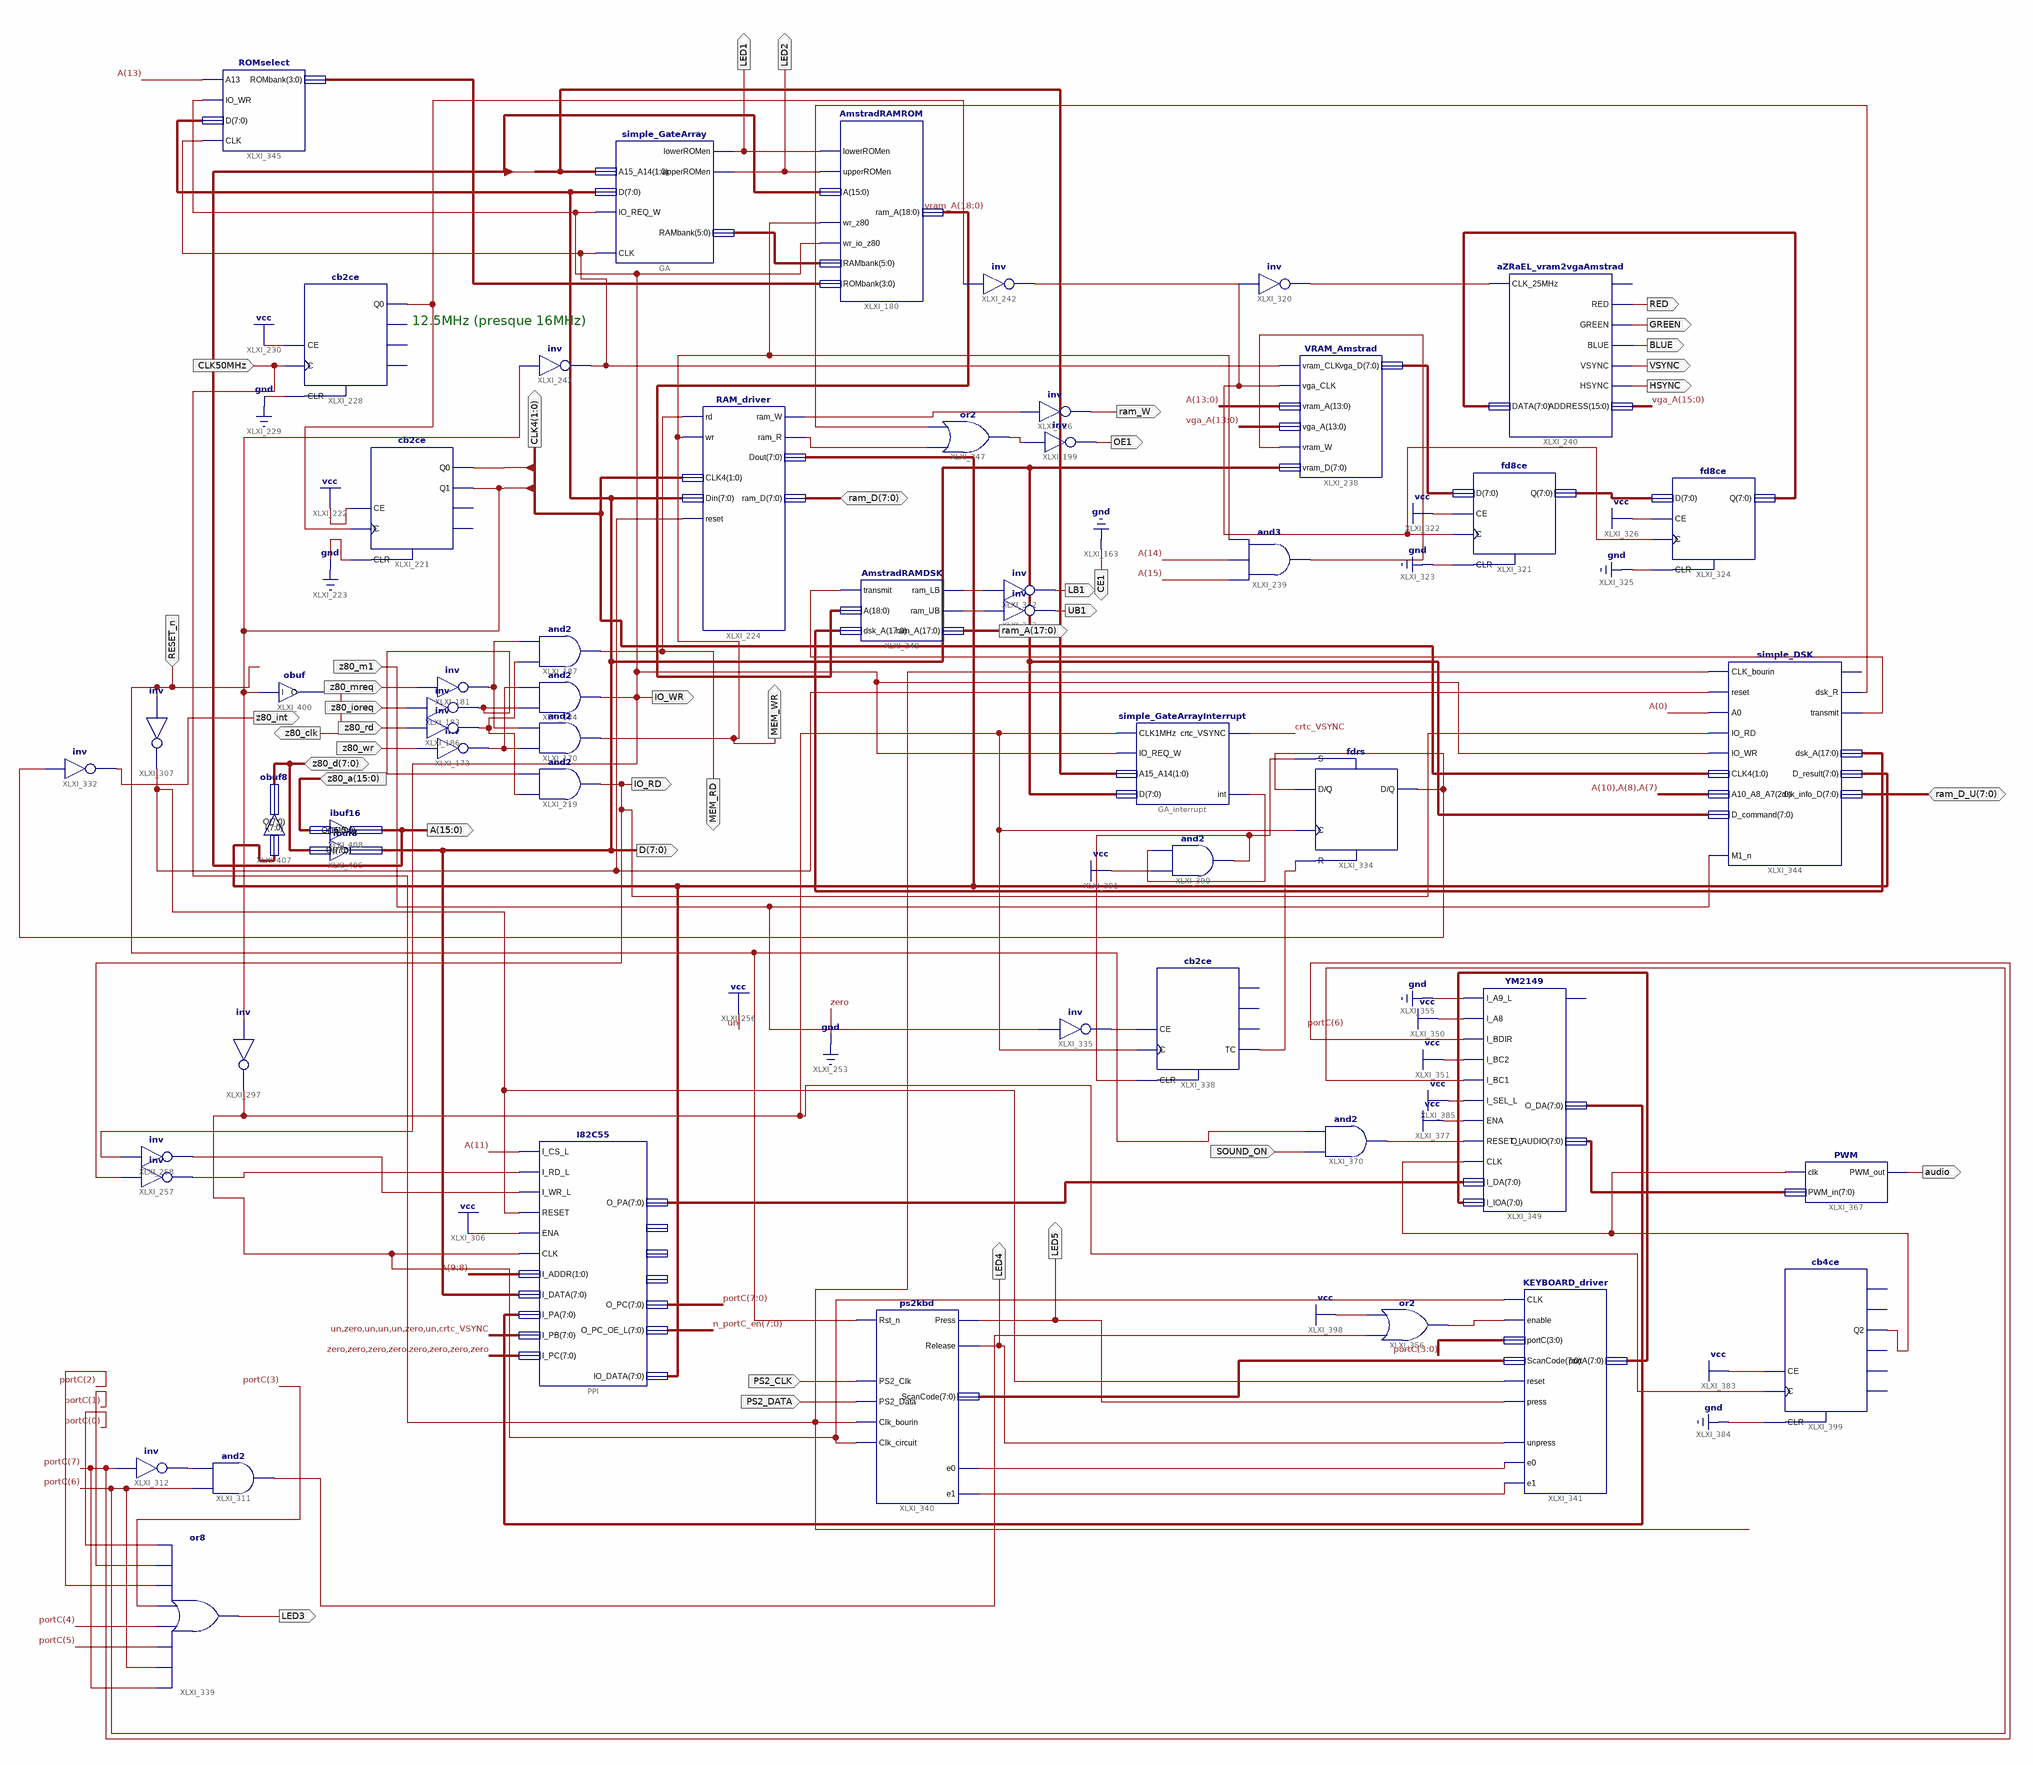
[diagram p0: schematic sheet 1]
// Xilinx ISE schematic amstrad_switch_z80_vga_externalZ80.sch (spartan3) as structural Verilog: 54 symbols, 40 ports
module amstrad_switch_z80_vga_externalZ80 (
  input  z80_wr,
  input  z80_mreq,
  input  z80_ioreq,
  input  z80_rd,
  input  RESET_n,
  input  CLK50MHz,
  input  z80_m1,
  input  PS2_CLK,
  input  PS2_DATA,
  input  SOUND_ON,
  input  [15:0] z80_a,
  inout  [7:0] ram_D,
  inout  [7:0] ram_D_U,
  inout  [7:0] z80_d,
  output LED1,
  output LED2,
  output [15:0] A,
  output IO_WR,
  output MEM_RD,
  output MEM_WR,
  output [7:0] D,
  output IO_RD,
  output [1:0] CLK4,
  output RED,
  output GREEN,
  output BLUE,
  output VSYNC,
  output HSYNC,
  output LED3,
  output LED5,
  output LED4,
  output CE1,
  output z80_int,
  output ram_W,
  output OE1,
  output UB1,
  output LB1,
  output [17:0] ram_A,
  output audio,
  output z80_clk
);

  wire crtc_VSYNC, XLXN_37, XLXN_76, XLXN_88, XLXN_115, XLXN_137, XLXN_142, XLXN_153, XLXN_180, XLXN_301,
       XLXN_309, XLXN_327, XLXN_337, XLXN_358, XLXN_359, XLXN_364, XLXN_370, XLXN_417, XLXN_418, XLXN_422,
       XLXN_423, XLXN_441, XLXN_445, XLXN_446, XLXN_450, XLXN_451, XLXN_459, XLXN_477, XLXN_478, XLXN_487,
       XLXN_497, XLXN_509, XLXN_521;
  wire [3:0] XLXN_435;
  wire [5:0] XLXN_434;
  wire [7:0] n_portC_en, portC, XLXN_283, XLXN_340, XLXN_344, XLXN_408, XLXN_452, XLXN_462, XLXN_486,
       XLXN_518, XLXN_519;
  wire [15:0] vga_A;
  wire [17:0] XLXN_427;
  wire [18:0] vram_A;

  and XLXI_170 (MEM_WR, XLXN_37, XLXN_115);
  not XLXI_173 (XLXN_37, z80_wr);
  simple_GateArray GA (
    .CLK(XLXN_441), .IO_REQ_W(IO_WR), .A15_A14(A[15:14]), .D(D), .lowerROMen(LED1), .upperROMen(LED2),
    .RAMbank(XLXN_434));
  not XLXI_181 (XLXN_115, z80_mreq);
  not XLXI_183 (XLXN_76, z80_ioreq);
  and XLXI_184 (IO_WR, XLXN_76, XLXN_37);
  not XLXI_186 (XLXN_88, z80_rd);
  and XLXI_187 (MEM_RD, XLXN_88, XLXN_115);
  AmstradRAMROM XLXI_180 (
    .wr_z80(MEM_WR), .wr_io_z80(IO_WR), .lowerROMen(LED1), .upperROMen(LED2), .A(A), .RAMbank(XLXN_434),
    .ROMbank(XLXN_435), .ram_A(vram_A));
  and XLXI_219 (IO_RD, XLXN_88, XLXN_76);
  cb2ce XLXI_221 (.C(XLXN_142), .CE(1'b1), .CLR(1'b0), .Q0(CLK4[0]), .Q1(CLK4[1]));  // open: CEO, TC
  RAM_driver XLXI_224 (
    .rd(MEM_RD), .wr(MEM_WR), .reset(XLXN_309), .CLK4(CLK4), .Din(D), .Dout(XLXN_283), .ram_D(ram_D),
    .ram_W(XLXN_446), .ram_R(XLXN_450));
  cb2ce XLXI_228 (.C(CLK50MHz), .CE(1'b1), .CLR(1'b0), .Q0(XLXN_142));  // open: CEO, Q1, TC
  VRAM_Amstrad XLXI_238 (
    .vram_CLK(XLXN_441), .vga_CLK(XLXN_153), .vram_A(A[13:0]), .vga_A(vga_A[13:0]), .vram_W(XLXN_137),
    .vram_D(D), .vga_D(XLXN_340));
  and XLXI_239 (XLXN_137, A[15], A[14], MEM_WR);
  aZRaEL_vram2vgaAmstrad XLXI_240 (
    .CLK_25MHz(XLXN_337), .DATA(XLXN_452), .RED(RED), .GREEN(GREEN), .BLUE(BLUE), .VSYNC(VSYNC),
    .HSYNC(HSYNC), .ADDRESS(vga_A));  // open: R
  not XLXI_242 (XLXN_153, XLXN_142);
  not XLXI_243 (XLXN_441, CLK4[1]);
  not XLXI_257 (XLXN_301, IO_RD);
  not XLXI_258 (XLXN_180, IO_WR);
  not XLXI_297 (XLXN_497, CLK4[1]);
  I82C55 PPI (
    .I_CS_L(A[11]), .I_RD_L(XLXN_301), .I_WR_L(XLXN_180), .RESET(XLXN_309), .ENA(1'b1), .CLK(XLXN_497),
    .I_ADDR(A[9:8]), .I_DATA(D), .I_PA(XLXN_519), .I_PB({7'b1011101, crtc_VSYNC}), .I_PC({8{1'b0}}),
    .IO_DATA(XLXN_283), .O_PA(XLXN_462), .O_PC(portC), .O_PC_OE_L(n_portC_en));  // open: O_PA_OE_L, O_PB, O_PB_OE_L
  not XLXI_307 (XLXN_309, RESET_n);
  and XLXI_311 (XLXN_477, portC[6], XLXN_327);
  not XLXI_312 (XLXN_327, portC[7]);
  not XLXI_320 (XLXN_337, XLXN_153);
  fd8ce XLXI_321 (.C(XLXN_153), .CE(1'b1), .CLR(1'b0), .D(XLXN_340), .Q(XLXN_344));
  fd8ce XLXI_324 (.C(XLXN_153), .CE(1'b1), .CLR(1'b0), .D(XLXN_344), .Q(XLXN_452));
  simple_GateArrayInterrupt GA_interrupt (
    .CLK1MHz(XLXN_497), .IO_REQ_W(IO_WR), .A15_A14(A[15:14]), .D(D), .crtc_VSYNC(crtc_VSYNC), .\int (XLXN_509));
  not XLXI_332 (z80_int, XLXN_359);
  fdrs XLXI_334 (.C(XLXN_497), .D(XLXN_359), .R(XLXN_364), .S(XLXN_358), .Q(XLXN_359));
  not XLXI_335 (XLXN_370, z80_m1);
  cb2ce XLXI_338 (.C(XLXN_497), .CE(XLXN_370), .CLR(XLXN_358), .TC(XLXN_364));  // open: CEO, Q0, Q1
  or XLXI_339 (LED3, portC[7], portC[6], portC[5], portC[4], portC[3], portC[2], portC[1], portC[0]);
  ps2kbd XLXI_340 (
    .Rst_n(RESET_n), .Clk_bourin(CLK50MHz), .Clk_circuit(XLXN_497), .PS2_Clk(PS2_CLK), .PS2_Data(PS2_DATA),
    .Press(LED5), .Release(LED4), .e0(XLXN_417), .e1(XLXN_418), .ScanCode(XLXN_408));
  KEYBOARD_driver XLXI_341 (
    .CLK(XLXN_497), .reset(XLXN_309), .enable(XLXN_478), .e0(XLXN_417), .e1(XLXN_418), .press(LED5),
    .unpress(LED4), .portC(portC[3:0]), .ScanCode(XLXN_408), .portA(XLXN_518));
  simple_DSK XLXI_344 (
    .CLK_bourin(CLK50MHz), .reset(XLXN_309), .A0(A[0]), .IO_RD(IO_RD), .IO_WR(IO_WR), .M1_n(z80_m1),
    .CLK4(CLK4), .A10_A8_A7({A[10], A[8:7]}), .D_command(D), .D_result(XLXN_283), .dsk_info_D(ram_D_U),
    .dsk_R(XLXN_445), .transmit(XLXN_459), .dsk_A(XLXN_427));  // open: dsk_W
  ROMselect XLXI_345 (.A13(A[13]), .IO_WR(IO_WR), .D(D), .ROMbank(XLXN_435), .CLK(XLXN_441));
  not XLXI_226 (ram_W, XLXN_446);
  or XLXI_347 (XLXN_451, XLXN_450, XLXN_445);
  not XLXI_199 (OE1, XLXN_451);
  AmstradRAMDSK XLXI_348 (
    .transmit(XLXN_459), .A(vram_A), .dsk_A(XLXN_427), .ram_LB(XLXN_422), .ram_UB(XLXN_423), .ram_A(ram_A));
  not XLXI_342 (LB1, XLXN_422);
  not XLXI_343 (UB1, XLXN_423);
  YM2149 XLXI_349 (
    .I_A9_L(1'b0), .I_A8(1'b1), .I_BDIR(portC[7]), .I_BC2(1'b1), .I_BC1(portC[6]), .I_SEL_L(1'b1),
    .ENA(1'b1), .RESET_L(XLXN_487), .CLK(XLXN_521), .I_DA(XLXN_462), .I_IOA(XLXN_518), .O_DA(XLXN_519),
    .O_AUDIO(XLXN_486));  // open: O_DA_OE_L
  or XLXI_356 (XLXN_478, XLXN_477, 1'b1);
  and XLXI_370 (XLXN_487, SOUND_ON, RESET_n);
  PWM XLXI_367 (.clk(XLXN_521), .PWM_in(XLXN_486), .PWM_out(audio));
  and XLXI_390 (XLXN_358, 1'b1, XLXN_509);
  cb4ce XLXI_399 (.C(XLXN_497), .CE(1'b1), .CLR(1'b0), .Q2(XLXN_521));  // open: CEO, Q0, Q1, Q3, TC
  obuf XLXI_400 (.I(CLK4[1]), .O(z80_clk));
  ibuf8 XLXI_406 (.I(z80_d), .O(D));
  obuf8 XLXI_407 (.I(XLXN_283), .O(z80_d));
  ibuf16 XLXI_408 (.I(z80_a), .O(A));

  assign CE1 = 1'b0;

  // Notes on the sheet:
  //   12.5MHz (presque 16MHz)
endmodule
